# Altium project DAQ_Project.PrjPcb
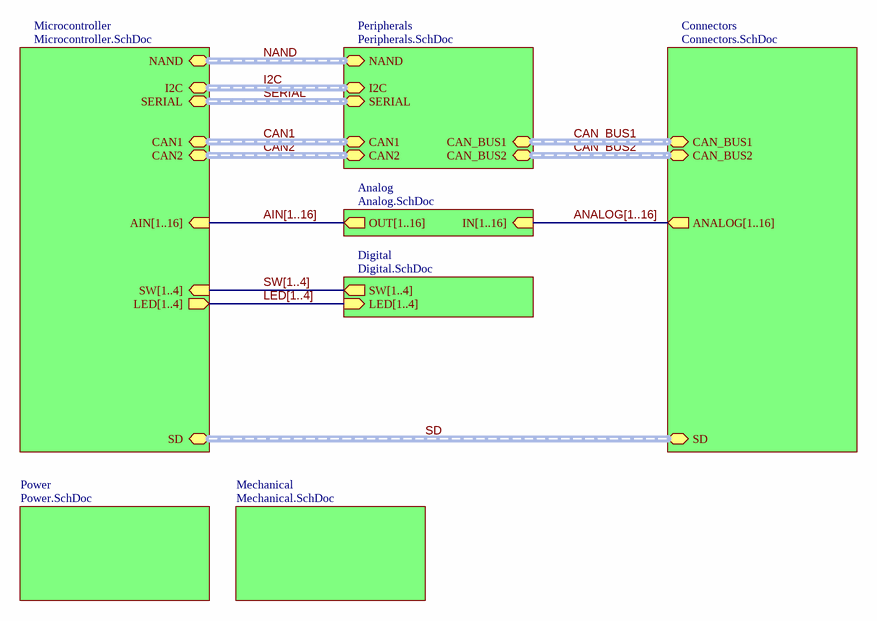
[diagram p0: Master.SchDoc]
2 sheets, 16 parts. Net scope: hierarchical (ports join the sheet entries above them; power ports are global).
Sheets:
  Master.SchDoc
    Microcontroller = Microcontroller.SchDoc

## Sheet Master.SchDoc: Top-Level Sheet
size Letter; Revision: 1.0; SheetNumber: 2; PageSetup: Record=PageOptions|CenterHorizontal=True|CenterVertical=True|PrintScale=1.00|XCorrection=1.00|YCorrection=1.00|PrintKind=1|BorderSize=5000000|LeftOffset=0|BottomOffset=0|Orientation=2|PaperLength=1000|PaperWidth=1000|Scale=100|PaperSource=7|PrintQuality=-3|MediaType=1|DitherType=10|PrintScaleMode=1|PaperKind=Letter|PaperIndex=1; ProjectTitle: Data Acquisition System

### Sub-sheets
Analog = Analog.SchDoc (file not in this document): OUT[1..16] (out), IN[1..16] (in)
Connectors = Connectors.SchDoc (file not in this document): CAN_BUS1 (harness CAN_BUS1), CAN_BUS2 (harness CAN_BUS2), SD (harness SD), ANALOG[1..16] (out)
Digital = Digital.SchDoc (file not in this document): SW[1..4] (out), LED[1..4] (in)
Mechanical = Mechanical.SchDoc (file not in this document): no entries
Microcontroller = Microcontroller.SchDoc: AIN[1..16] (in), SW[1..4] (in), LED[1..4] (out), SD (harness SD), CAN1 (harness CAN1), CAN2 (harness CAN2), NAND (harness NAND), I2C (harness I2C), SERIAL (harness SERIAL)
Peripherals = Peripherals.SchDoc (file not in this document): CAN1 (harness CAN1), CAN2 (harness CAN2), NAND (harness NAND), CAN_BUS1 (harness CAN_BUS1), CAN_BUS2 (harness CAN_BUS2), I2C (harness I2C), SERIAL (harness SERIAL)
Power = Power.SchDoc (file not in this document): no entries

### Buses and harness runs
bus AIN[1..16] = sheet Analog/OUT[1..16] = sheet Microcontroller/AIN[1..16]
bus ANALOG[1..16] = sheet Analog/IN[1..16] = sheet Connectors/ANALOG[1..16]
bus LED[1..4] = sheet Digital/LED[1..4] = sheet Microcontroller/LED[1..4]
bus SW[1..4] = sheet Digital/SW[1..4] = sheet Microcontroller/SW[1..4]
harness CAN1 = sheet Microcontroller/CAN1 = sheet Peripherals/CAN1
harness CAN2 = sheet Microcontroller/CAN2 = sheet Peripherals/CAN2
harness CAN_BUS1 = sheet Connectors/CAN_BUS1 = sheet Peripherals/CAN_BUS1
harness CAN_BUS2 = sheet Connectors/CAN_BUS2 = sheet Peripherals/CAN_BUS2
harness I2C = sheet Microcontroller/I2C = sheet Peripherals/I2C
harness NAND = sheet Microcontroller/NAND = sheet Peripherals/NAND
harness SD = sheet Connectors/SD = sheet Microcontroller/SD
harness SERIAL = sheet Microcontroller/SERIAL = sheet Peripherals/SERIAL

### Notes on the sheet
- Date:
- Revision:
- Sheet
- of

## Sheet Microcontroller.SchDoc: Microcontroller
size Letter; Revision: 1.0; SheetNumber: 3; PageSetup: Record=PageOptions|CenterHorizontal=True|CenterVertical=True|PrintScale=1.00|XCorrection=1.00|YCorrection=1.00|PrintKind=1|BorderSize=5000000|LeftOffset=0|BottomOffset=0|Orientation=2|PaperLength=1000|PaperWidth=1000|Scale=100|PaperSource=7|PrintQuality=-3|MediaType=1|DitherType=10|PrintScaleMode=1|PaperKind=Letter|PaperIndex=1; ProjectTitle: Data Acquisition System
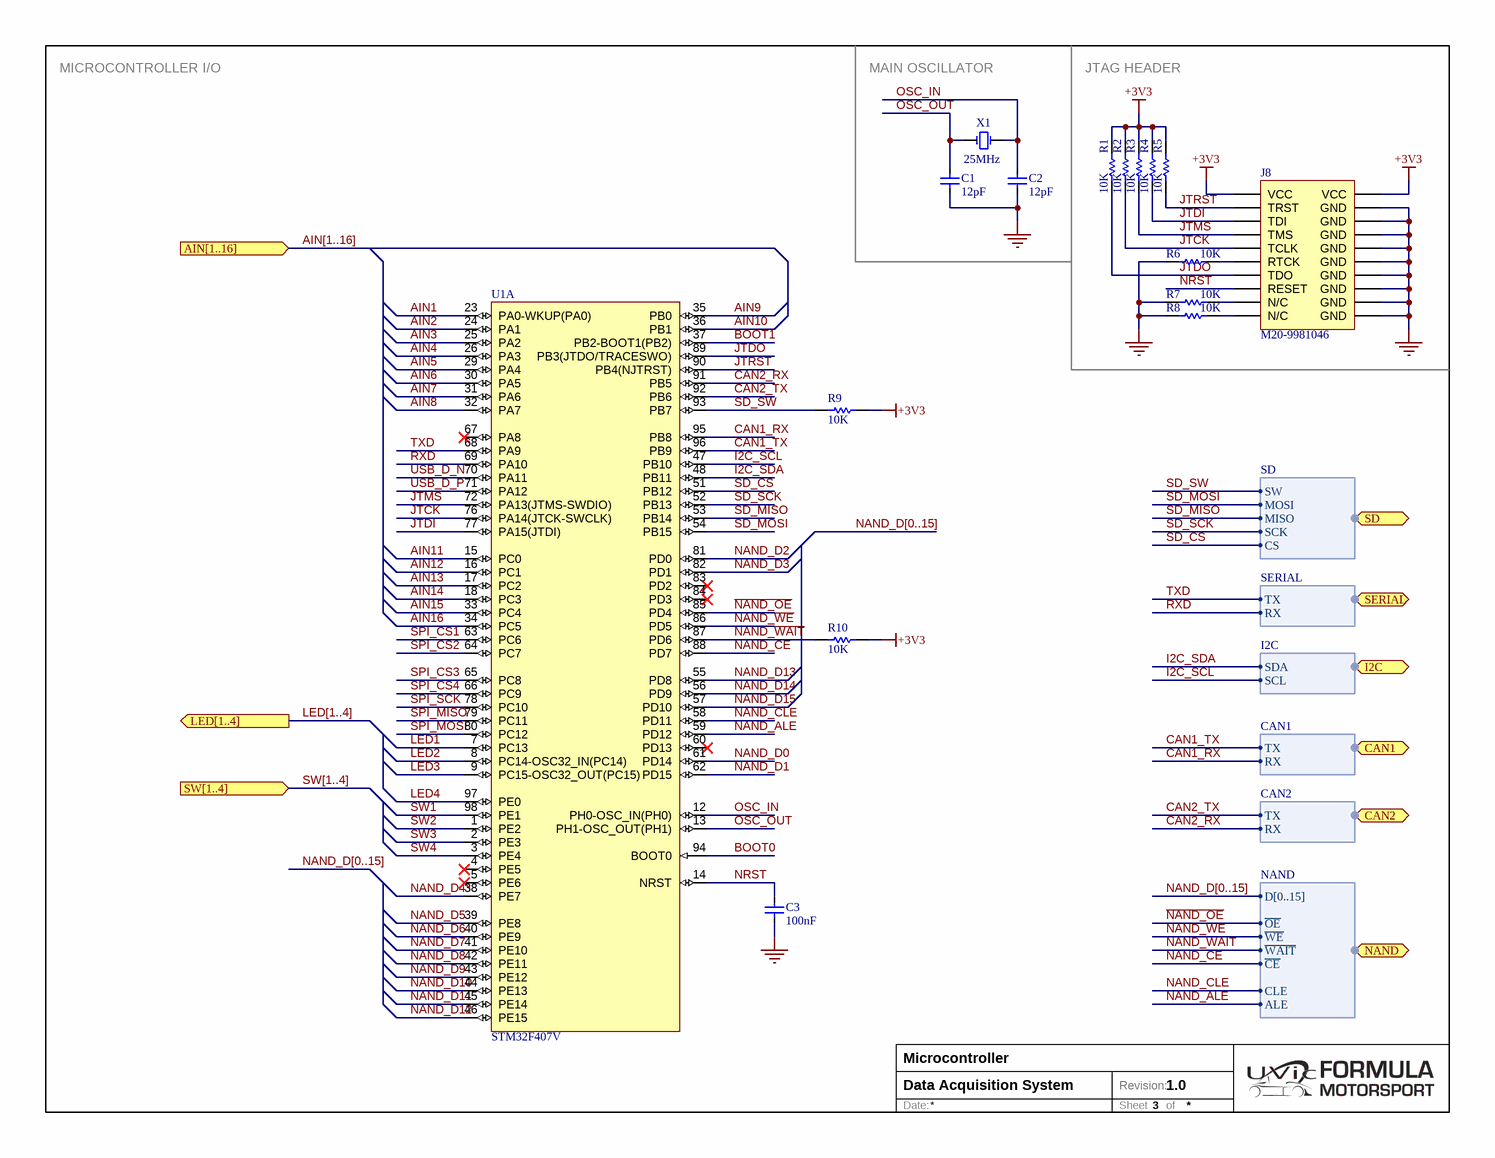
[diagram p1: Microcontroller.SchDoc]

### Parts
C1  value 12pF  [CAP-0603-M]  (hidden comment: Capacitor 12pF 50V 0603)
C2  value 12pF  [CAP-0603-M]  (hidden comment: Capacitor 12pF 50V 0603)
C3  value 100nF  [CAP-0603-M]  (hidden comment: Capacitor 100nF 25V 0603)
J8  M20-9981046  [M20-9981046]
R1  value 10K  [RES-0603-M]  (hidden comment: Resistor 10K 1/10 W 0603)
R2  value 10K  [RES-0603-M]  (hidden comment: Resistor 10K 1/10 W 0603)
R3  value 10K  [RES-0603-M]  (hidden comment: Resistor 10K 1/10 W 0603)
R4  value 10K  [RES-0603-M]  (hidden comment: Resistor 10K 1/10 W 0603)
R5  value 10K  [RES-0603-M]  (hidden comment: Resistor 10K 1/10 W 0603)
R6  value 10K  [RES-0603-M]  (hidden comment: Resistor 10K 1/10 W 0603)
R7  value 10K  [RES-0603-M]  (hidden comment: Resistor 10K 1/10 W 0603)
R8  value 10K  [RES-0603-M]  (hidden comment: Resistor 10K 1/10 W 0603)
R9  value 10K  [RES-0603-M]  (hidden comment: Resistor 10K 1/10 W 0603)
R10  value 10K  [RES-0603-M]  (hidden comment: Resistor 10K 1/10 W 0603)
U1  STM32F407V  [100-LQFP-14x14-0.5]  (part A of 2)
X1  value 25MHz  [TXC-AA]  (hidden comment: AA-25.000M)

### Ports
AIN[1..16] (in), CAN1 (harness CAN1), CAN2 (harness CAN2), I2C (harness I2C), LED[1..4] (out), NAND (harness NAND), SD (harness SD), SERIAL (harness SERIAL), SW[1..4] (in)

### Harnesses
SD: MOSI, MISO, SCK, CS, SW
CAN1: TX, RX
CAN2: TX, RX
NAND: D[0..15], ~{OE}, ~{WE}, ~{WAIT}, ~{CE}, CLE, ALE
I2C: SDA, SCL
SERIAL: TX, RX

### Nets
+3V3: J8.1(VCC) J8.2(VCC) R1.1 R2.1 R3.1 R4.1 R5.1 R9.1 R10.1
GND: C1.1 C2.1 C3.2 J8.4(GND) J8.6(GND) J8.8(GND) J8.10(GND) J8.12(GND) J8.14(GND) J8.16(GND) J8.18(GND) J8.20(GND) R6.2 R7.2 R8.2
AIN1: U1.23(PA0-WKUP(PA0))
AIN2: U1.24(PA1)
AIN3: U1.25(PA2)
AIN4: U1.26(PA3)
AIN5: U1.29(PA4)
AIN6: U1.30(PA5)
AIN7: U1.31(PA6)
AIN8: U1.32(PA7)
AIN9: U1.35(PB0)
AIN10: U1.36(PB1)
AIN11: U1.15(PC0)
AIN12: U1.16(PC1)
AIN13: U1.17(PC2)
AIN14: U1.18(PC3)
AIN15: U1.33(PC4)
AIN16: U1.34(PC5)
BOOT0: U1.94(BOOT0)
BOOT1: U1.37(PB2-BOOT1(PB2))
CAN1_RX: U1.95(PB8) ; port CAN1.RX  [project net CAN1.RX]
CAN1_TX: U1.96(PB9) ; port CAN1.TX  [project net CAN1.TX]
CAN2_RX: U1.91(PB5) ; port CAN2.RX  [project net CAN2.RX]
CAN2_TX: U1.92(PB6) ; port CAN2.TX  [project net CAN2.TX]
I2C_SCL: U1.47(PB10) ; port I2C.SCL  [project net I2C.SCL]
I2C_SDA: U1.48(PB11) ; port I2C.SDA  [project net I2C.SDA]
JTCK: J8.9(TCLK) R2.2 U1.76(PA14(JTCK-SWCLK))
JTDI: J8.5(TDI) R4.2 U1.77(PA15(JTDI))
JTDO: J8.13(TDO) R1.2 U1.89(PB3(JTDO/TRACESWO))
JTMS: J8.7(TMS) R3.2 U1.72(PA13(JTMS-SWDIO))
JTRST: J8.3(TRST) R5.2 U1.90(PB4(NJTRST))
LED1: U1.7(PC13)
LED2: U1.8(PC14-OSC32_IN(PC14))
LED3: U1.9(PC15-OSC32_OUT(PC15))
LED4: U1.97(PE0)
~{NAND_CE}: U1.88(PD7) ; port NAND.~{CE}
~{NAND_OE}: U1.85(PD4) ; port NAND.~{OE}
~{NAND_WAIT}: R10.2 U1.87(PD6) ; port NAND.~{WAIT}
~{NAND_WE}: U1.86(PD5) ; port NAND.~{WE}
NAND_ALE: U1.59(PD12) ; port NAND.ALE  [project net NAND.ALE]
NAND_CLE: U1.58(PD11) ; port NAND.CLE  [project net NAND.CLE]
NAND_D0: U1.61(PD14)
NAND_D1: U1.62(PD15)
NAND_D2: U1.81(PD0)
NAND_D3: U1.82(PD1)
NAND_D4: U1.38(PE7)
NAND_D5: U1.39(PE8)
NAND_D6: U1.40(PE9)
NAND_D7: U1.41(PE10)
NAND_D8: U1.42(PE11)
NAND_D9: U1.43(PE12)
NAND_D10: U1.44(PE13)
NAND_D11: U1.45(PE14)
NAND_D12: U1.46(PE15)
NAND_D13: U1.55(PD8)
NAND_D14: U1.56(PD9)
NAND_D15: U1.57(PD10)
NRST: C3.1 J8.15(RESET) U1.14(NRST)
OSC_IN: C2.2 U1.12(PH0-OSC_IN(PH0)) X1.2
OSC_OUT: C1.2 U1.13(PH1-OSC_OUT(PH1)) X1.1
RXD: U1.69(PA10) ; port SERIAL.RX
SD_CS: U1.51(PB12) ; port SD.CS  [project net SD.CS]
SD_MISO: U1.53(PB14) ; port SD.MISO  [project net SD.MISO]
SD_MOSI: U1.54(PB15) ; port SD.MOSI  [project net SD.MOSI]
SD_SCK: U1.52(PB13) ; port SD.SCK  [project net SD.SCK]
SD_SW: R9.2 U1.93(PB7) ; port SD.SW  [project net SD.SW]
SPI_CS1: U1.63(PC6)
SPI_CS2: U1.64(PC7)
SPI_CS3: U1.65(PC8)
SPI_CS4: U1.66(PC9)
SPI_MISO: U1.79(PC11)
SPI_MOSI: U1.80(PC12)
SPI_SCK: U1.78(PC10)
SW1: U1.98(PE1)
SW2: U1.1(PE2)
SW3: U1.2(PE3)
SW4: U1.3(PE4)
TXD: U1.68(PA9) ; port SERIAL.TX  [project net SERIAL.TX]
USB_D_N: U1.70(PA11)
USB_D_P: U1.71(PA12)
NetJ8_11: J8.11(RTCK) R6.1
NetJ8_17: J8.17(N/C) R7.1
NetJ8_19: J8.19(N/C) R8.1

Not connected (* = marked no-connect by the designer): U1 4(PE5)* 5(PE6)* 60(PD13)* 67(PA8)* 83(PD2)* 84(PD3)*

### Buses and harness runs
bus AIN[1..16] = port AIN[1..16]
bus LED[1..4] = port LED[1..4]
bus NAND_D[0..15]
bus SW[1..4] = port SW[1..4]

### Notes on the sheet
- MICROCONTROLLER I/O
- MAIN OSCILLATOR
- JTAG HEADER
- Date:
- Revision:
- Sheet
- of

### Library data of the parts
C1 C2 = CC0603JRNPO9BN120: Manufacturer: Yageo; Manufacturer Series: CC; Tolerance: ±5%; Temperature Coefficient: C0G, NP0; Part Number: CC0603JRNPO9BN120; Component Type: Standard; Voltage: 50V; Package: 0603; Temperature Range: -55°C ~ 125°C; Supplier 1: Digi-Key; Supplier Part Number 1: 311-1059-1-ND
C3 = CC0603KRX7R8BB104: Manufacturer: Yageo; Manufacturer Series: CC; Tolerance: ±10%; Temperature Coefficient: X7R; Part Number: CC0603KRX7R8BB104; Component Type: Standard; Voltage: 25V; Package: 0603; Temperature Range: -55°C ~ 125°C; Supplier 1: Digi-Key; Supplier Part Number 1: 311-1341-1-ND
J8 = M20-9981046: 2.54mm Header 2x10-Pin; Supplier 1: Digi-Key; Supplier Part Number 1: 952-2130-ND
R1-R10 = RC0603FR-0710KL: Manufacturer: Yageo; Manufacturer Series: RC; Tolerance: 1%; Power: 1/10 W; Temperature Coefficient: ±100ppm/°C; Part Number: RC0603FR-0710KL; Component Type: Standard; Package: 0603; Temperature Range: -55°C ~ 155°C; Supplier 1: Digi-Key; Supplier Part Number 1: 311-10.0KHRCT-ND
U1 = STM32F407V: STM32F407 100-LQFP; Supplier 1: Digi-Key; Supplier Part Number 1: 497-11605-ND
X1 = AA-25.000M: TXC AA SMD Automotive Crystal; Supplier 1: Digi-Key; Supplier Part Number 1: 887-1662-1-ND